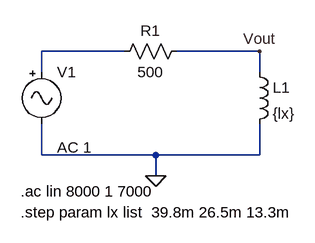
[diagram p0: schematic 3_12_pablo_gomez_tp6_ej4.asc]
3_12_pablo_gomez_tp6_ej4.asc, the LTspice schematic file:
Version 4
SHEET 1 880 680
WIRE 64 128 -64 128
WIRE 272 128 144 128
WIRE -64 160 -64 128
WIRE 272 160 272 128
WIRE -64 288 -64 240
WIRE 112 288 -64 288
WIRE 272 288 272 240
WIRE 272 288 112 288
WIRE 112 320 112 288
FLAG 272 128 Vout
FLAG 112 320 0
SYMBOL ind 256 144 R0
SYMATTR InstName L1
SYMATTR Value {lx}
SYMBOL res 160 112 R90
WINDOW 0 0 56 VBottom 2
WINDOW 3 32 56 VTop 2
SYMATTR InstName R1
SYMATTR Value 500
SYMBOL Misc\\signal -64 144 R0
WINDOW 123 24 132 Left 2
WINDOW 39 0 0 Left 0
SYMATTR Value2 AC 1
SYMATTR InstName V1
SYMATTR Value ""
TEXT -96 344 Left 2 !.ac lin 8000 1 7000
TEXT -96 376 Left 2 !.step param lx list  39.8m 26.5m 13.3m

The netlist it stands for:
* 3_12_pablo_gomez_tp6_ej4.asc
L1 Vout 0 {lx}
R1 Vout N001 500
V1 N001 0 AC 1
.ac lin 8000 1 7000
.step param lx list  39.8m 26.5m 13.3m
.backanno
.end